# Altium schematic sheet SD.SchDoc
size A4; SheetNumber: 8; SheetTotal: 8
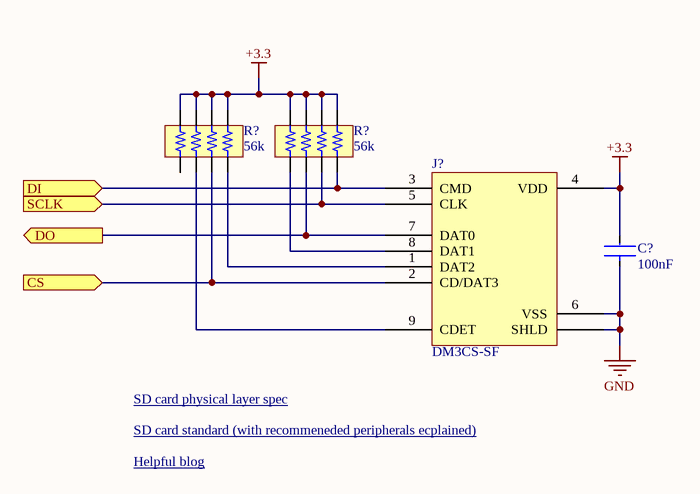
[diagram p0: SD.SchDoc]

## Parts
(Parts that share a designator on the sheet are numbered #1, #2 ... from top to bottom, then left to right.)
C?  value 100nF  [FP-CGA3E-0_3-0_1-IPC_C]  (hidden comment: CER 0.1UF 50V X7R 0603)
J?  DM3CS-SF  [HIROSE DM3CS]
R?#1  Resistance (Ohms): 56k  [RESNET 0804-8 CONVEX]  (hidden comment: EXB-28V563JX)
R?#2  Resistance (Ohms): 56k  [RESNET 0804-8 CONVEX]  (hidden comment: EXB-28V563JX)

## Ports
CS (in), DI (in), DO (out), SCLK (in)

## Nets
+3.3: C?.2 J?.4(VDD) R?#1.5 R?#1.6 R?#1.7 R?#1.8 R?#2.1 R?#2.2 R?#2.3 R?#2.4
GND: C?.1 J?.6(VSS) J?.S(SHLD)
CS: J?.2(CD/DAT3) R?#1.3 ; port CS
DI: J?.3(CMD) R?#2.8 ; port DI
DO: J?.7(DAT0) R?#2.6 ; port DO
SCLK: J?.5(CLK) R?#2.7 ; port SCLK
NetJ?_1: J?.1(DAT2) R?#1.4
NetJ?_8: J?.8(DAT1) R?#2.5
NetJ?_9: J?.9(CDET) R?#1.2

Not connected (* = marked no-connect by the designer): R?#1 1

## Notes on the sheet
- SD card physical layer spec <http://users.ece.utexas.edu/~valvano/EE345M/SD_Physical_Layer_Spec.pdf >
- SD card standard (with recommeneded peripherals ecplained) <https://www.jedec.org/system/files/docs/JESD84-A41.pdf>
- Helpful blog <http://elm-chan.org/docs/mmc/mmc_e.html>

## Library data of the parts
C? = CGA3E2X7R1H104K080AA: Manufacturer: TDK; Dielectric Material: Ceramic; Multilayer: Yes; Tolerance  (fill in as +-): 10%; Reference Standard: AEC-Q200; Supplier: Digi-Key; Supplier Part Number: 445-5666-1-ND; Manufacturer Part Number: CGA3E2X7R1H104K080AA; RoHS: Yes; Category: Ceramic Capacitors; Stock: 7530246; Pricing: 1=0.1, 10=0.067, 50=0.0364, 100=0.0297, 500=0.0212, 1000=0.01666 (USD); Mounting Technology: Surface Mount; Pins: 2; Package Shape: Rectangular; Case/Package: 0603; Terminal Finish: Nickel; Min Operating Temperature: -55°C; Max Operating Temperature: 125°C; Capacitor Type: Ceramic; JESD-609 Code: e3; Package Style: SMTMeter; Packaging: Tape and Reel; Tolerance (fill in as +-): 10%; Rated DC Voltage (URdc): 50V; Temperature Characteristics Code: X7R; Termination: Wraparound; Length: 1.6mm; Width: 0.8mm; Height: 0.8mm; Reach SVHC Compliant: Yes; RoHS Compliant: Yes; ComponentLink1URL: https://datasheet.ciiva.com:443/pdfs/VipMasterIC/IC/TDKC/TDKC-S-A0008953915/TDKC-S-A0008953915-1.pdf?src-supplier=IHS+Markit; ComponentLink1Description: https://datasheet.ciiva.com:443/pdfs/VipMasterIC/IC/TDKC/TDKC-S-A0008953915/TDKC-S-A0008953915-1.pdf?src-supplier=IHS+Markit; ComponentLink2URL: https://datasheet.ciiva.com/24216/cga3e2x7r1h104k080aa-266291-24216208.pdf?src-supplier=Mouser; ComponentLink2Description: https://datasheet.ciiva.com/24216/cga3e2x7r1h104k080aa-266291-24216208.pdf?src-supplier=Mouser; ComponentLink3URL: https://datasheet.ciiva.com/15192/getdatasheetpartid-715867-15192412.pdf?src-supplier=Verical; ComponentLink3Description: https://datasheet.ciiva.com/15192/getdatasheetpartid-715867-15192412.pdf?src-supplier=Verical; ComponentLink4URL: https://datasheet.ciiva.com/23803/1936565-23803084.pdf?src-supplier=Newark; ComponentLink4Description: https://datasheet.ciiva.com/23803/1936565-23803084.pdf?src-supplier=Newark; ComponentLink5URL: https://datasheet.ciiva.com/22725/1735392-22725642.pdf?src-supplier=Element14; ComponentLink5Description: https://datasheet.ciiva.com/22725/1735392-22725642.pdf?src-supplier=Element14; ComponentLink6URL: https://datasheet.ciiva.com/46385/1735392-46385708.pdf?src-supplier=Element14; ComponentLink6Description: https://datasheet.ciiva.com/46385/1735392-46385708.pdf?src-supplier=Element14; ComponentLink7URL: https://datasheet.ciiva.com/16500/mlccspec-automotive-general-midvoltage-en-16500693.pdf?src-supplier=Future+Electronics; ComponentLink7Description: https://datasheet.ciiva.com/16500/mlccspec-automotive-general-midvoltage-en-16500693.pdf?src-supplier=Future+Electronics
J? = DM3CS-SF: CONN MICRO SD CARD HINGED TYPE; Manufacturer: Hirose Electric Co Ltd; Card Type: Secure Digital - microSD™; Connector Type: Connector; Insertion, Removal Method: Hinged Lid; Number of Positions: 10 (8 + 2); Part Number: DM3CS-SF; ComponentLink1Description: Datasheet; ComponentLink1URL: https://www.hirose.com/product/document?clcode=CL0609-0033-6-00&productname=DM3AT-SF-PEJ2M5&series=DM3&documenttype=Catalog&lang=en&documentid=D49662_en; ComponentLink2Description: DigiKey Link; ComponentLink2URL: //digikey.com/product-detail/en/hirose-electric-co-ltd/DM3CS-SF/HR1972TR-ND/2602739; Contact Finish: Gold; Features: Switch; Height Above Board: 0.072" (1.83mm); LastUpdated: 2019-12-16 8:36:12 PM; Lifecycle Status: 0; Minimum Order: 1; Mounting Feature: Normal, Standard - Top; Mounting Type: Surface Mount, Right Angle; Packaging: TapeAndReel; Part Status: Active; Price: 0.77; Series: DM3; Supplier 1: DigiKey; Supplier Part Number 1: HR1972TR-ND
R?#1 R?#2 = EXB-28V563JX: RES ARRAY 4 RES 56K OHM 0804; Manufacturer: Panasonic Electronic Components; Circuit Type: Isolated; Number of Resistors: 4; Power Per Element: 62.5mW; Temperature Coefficient: ±200ppm/°C; Tolerance: ±5%; Part Number: EXB-28V563JX; Applications: Automotive AEC-Q200; ComponentLink1Description: Datasheet; ComponentLink1URL: https://industrial.panasonic.com/cdbs/www-data/pdf/AOC0000/AOC0000C14.pdf; ComponentLink2Description: DigiKey Link; ComponentLink2URL: https://www.digikey.com/en/products/detail/panasonic-electronic-components/EXB-28V563JX/256308; Height - Seated (Max): 0.018" (0.45mm); LastUpdated: 2023-06-05 8:46:36 PM; Lifecycle Status: Active; Minimum Order: 1; Mounting Type: Surface Mount; Number of Pins: 8; Operating Temperature: -55°C ~ 125°C; Package / Case: 0804, Convex, Long Side Terminals; Packaging: TapeAndReel; PartId: 421; Part Status: Active; Price: 0.01; Series: EXB; Size / Dimension: 0.079" L x 0.039" W (2.00mm x 1.00mm); Supplier 1: DigiKey; Supplier Part Number 1: Y7563CT-ND; Supplier Device Package: 0804